# Altium schematic sheet Sheet1.SchDoc
size A; SheetNumber: 1; SheetTotal: 1
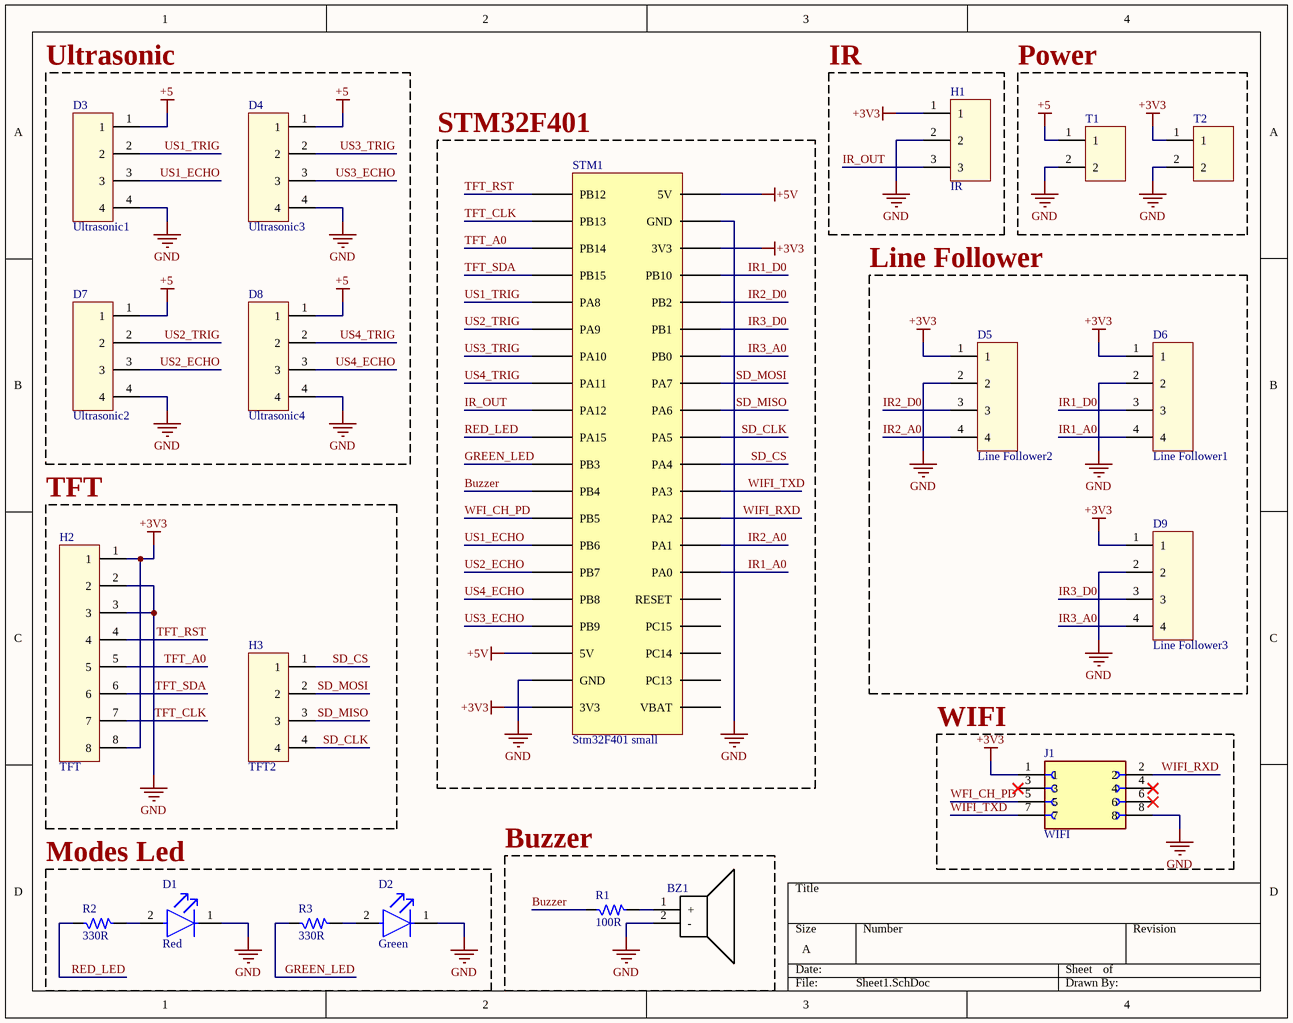
[diagram p0: Sheet1.SchDoc]

## Parts
BZ1  PS1440P02BT  [BUZZ_PS1440P02BT_TH]  (value not drawn)
D1  Red  [FP-HLMP-1301-MFG]
D2  Green  [FP-HLMP-1503-MFG]
D3  Ultrasonic1  [DATA_PIN_HEADER_4_2.54m]
D4  Ultrasonic3  [DATA_PIN_HEADER_4_2.54m]
D5  Line Follower2  [DATA_PIN_HEADER_4_2.54m]
D6  Line Follower1  [DATA_PIN_HEADER_4_2.54m]
D7  Ultrasonic2  [DATA_PIN_HEADER_4_2.54m]
D8  Ultrasonic4  [DATA_PIN_HEADER_4_2.54m]
D9  Line Follower3  [DATA_PIN_HEADER_4_2.54m]
H1  IR  [Female_Header_3]
H2  TFT  [Female_Header_8]
H3  TFT2  [Female_Header_4]
J1  WIFI  [SULLINS_PPPC042LFBN-RC]
R1  100R  [RES_1206]
R2  330R  [RES_0603]
R3  330R  [RES_0603]
STM1  Stm32F401 small  [Stm32F401CCU6]
T1  Terminal_block_2pins_5mm  [Terminal_block_2pins_5mm]  (value not drawn)
T2  Terminal_block_2pins_5mm  [Terminal_block_2pins_5mm]  (value not drawn)

## Blocks framed on the sheet
Ultrasonic: D3 D4 D7 D8
IR: H1
Power: T1 T2
STM32F401: STM1
Line Follower: D5 D6 D9
TFT: H2 H3
WIFI: J1
Modes Led: D1 D2 R2 R3
Buzzer: BZ1 R1

## Nets
+3V3: D5.1 D6.1 D9.1 H1.1 H2.1 H2.8 J1.1 STM1.3V3 T2.1
+5: D3.1 D4.1 D7.1 D8.1 T1.1
+5V: STM1.5V
GND: BZ1.2(-) D1.1(C) D2.1(C) D3.4 D4.4 D5.2 D6.2 D7.4 D8.4 D9.2 H1.2 H2.2 H2.3 J1.8 STM1.GND T1.2 T2.2
Buzzer: R1.1 STM1.PB4
GREEN_LED: R3.1 STM1.PB3
IR1_A0: D6.4 STM1.PA0
IR1_D0: D6.3 STM1.PB10
IR2_A0: D5.4 STM1.PA1
IR2_D0: D5.3 STM1.PB2
IR3_A0: D9.4 STM1.PB0
IR3_D0: D9.3 STM1.PB1
IR_OUT: H1.3 STM1.PA12
RED_LED: R2.1 STM1.PA15
SD_CLK: H3.4 STM1.PA5
SD_CS: H3.1 STM1.PA4
SD_MISO: H3.3 STM1.PA6
SD_MOSI: H3.2 STM1.PA7
TFT_A0: H2.5 STM1.PB14
TFT_CLK: H2.7 STM1.PB13
TFT_RST: H2.4 STM1.PB12
TFT_SDA: H2.6 STM1.PB15
US1_ECHO: D3.3 STM1.PB6
US1_TRIG: D3.2 STM1.PA8
US2_ECHO: D7.3 STM1.PB7
US2_TRIG: D7.2 STM1.PA9
US3_ECHO: D4.3 STM1.PB9
US3_TRIG: D4.2 STM1.PA10
US4_ECHO: D8.3 STM1.PB8
US4_TRIG: D8.2 STM1.PA11
WFI_CH_PD: J1.5 STM1.PB5
WIFI_RXD: J1.2 STM1.PA2
WIFI_TXD: J1.7 STM1.PA3
NetBZ1_1: BZ1.1(+) R1.2
NetD1_2: D1.2(A) R2.2
NetD2_2: D2.2(A) R3.2

Not connected (* = marked no-connect by the designer): J1 3* 4* 6*; STM1 PC13 PC14 PC15 RESET VBAT

## Library data of the parts
BZ1 = BUZZ_PS1440P02BT-30V-TH: Buzzers Transducer, Externally Driven Piezo 3V  4kHz 75dB @ 3V, 10cm Through Hole PC Pins; Manufacturer: TDK Corporation; Alternate Part Number-1: NA; Manufacturer Part Number: PS1440P02BT; Case/Package: TH; Supplier-1: SP ROAD; Supplier Part Number-1: NA
D1 = CMP-18399-000007-1: LED RED DIFFUSED T-1 T/H; Manufacturer: Broadcom; Forward Current: 10mA; Max Junction Temp: +110°C; Wavelength: 626nm; Led Orientation: Straight; Viewing Angle: 60°; Description: LED Uni-Color Red 635nm 2-Pin T-1; Luminous Intensity: 3.4mcd; Forward Voltage: 1.9V; Reverse Voltage: 5V; Peak Emmision Wavelength: 635nm; Mouser Description: Standard LEDs - Through Hole Red Diffused 635nm 3.4mcd; RoHS: TRUE; ComponentLink2Description: Datasheet; Device Class L1: Optoelectronics; Temperature Range High: +100°C; Manufacturer Part Number: HLMP-1301; ComponentLink2URL: https://docs.broadcom.com/docs/AV02-1555EN; Colour: Red; Digikey Description: LED RED DIFFUSED T-1 T/H; Automotive: No; Device Class L2: LEDs; Temperature Range Low: -40°C; Octopart: https://octopart.com/hlmp-1301-broadcom-71130345; Category: Diode; Lead Free: Yes; Device Class L3: unset; Package: 0; Temperature: -40°C to +100°C
D2 = CMP-18399-000010-1: LED GREEN DIFFUSED T-1 T/H; Manufacturer: Broadcom; Reverse Voltage: 5V; Wavelength: 569nm; Forward Voltage: 2.1V; Led Orientation: Straight; Viewing Angle: 60°; Max Junction Temp: +110°C; Peak Emmision Wavelength: 565nm; Luminous Intensity: 1mcd; Standoff Height: 0.88mm; Forward Current: 10mA; Mouser Description: LED; Green; 1mcd; 0.115In.Dia.; T-1; 565nm; 25mA; 2.1V; 5V; GaP; -20degC; 100deg; ComponentLink2Description: Datasheet; Digikey Description: LED GREEN DIFFUSED T-1 T/H; Device Class L1: Optoelectronics; Device Class L3: unset; Automotive: No; Device Class L2: LEDs; Manufacturer Part Number: HLMP-1503; Category: Diode; Temperature Range Low: -20°C; Height: 6.35mm; RoHS: TRUE; Octopart: https://octopart.com/hlmp-1503-broadcom-71130371; Temperature: -20°C to +100°C; Lead Free: Yes; ComponentLink2URL: https://docs.broadcom.com/docs/AV02-1555EN; Package: HLMP-1503; Colour: Green; Temperature Range High: +100°C
D3-D9 = DATA_PIN_HEADER_4_2.54m
H1 = FEMALE_HEADER_3
H2 = FEMALE_HEADER_8
H3 = FEMALE_HEADER_4
J1 = PPPC042LFBN-RC: 8 Position Total Dual Row 2.54 mm Pitch Straight Female Header; MF: Sullins Connector Solutions; MP: PPPC042LFBNRC; SnapEDA_Link: https://www.snapeda.com/parts/PPPC042LFBNRC/Sullins/view-part/?ref=snap; Package: None; Value: *; Check_prices: https://www.snapeda.com/parts/PPPC042LFBNRC/Sullins/view-part/?ref=eda
R1 = RES_10R-0.25W-5%-1206: 10 Ohms ±5% 0.25W, 1/4W Chip Resistor 1206 (3216 Metric) Automotive AEC-Q200 Thick Film; Manufacturer: Yageo; Manufacturer Part Number: RMCF1206JT10R0; Alternate Part Number-1: NA; Case/Package: 1206; Supplier-1: SIRICOM; Supplier Part Number-1: WR12X10R0FTL
R2 R3 = RES_2.2K-0.1W-1%-0603: 2.2 kOhms ±1% 0.1W, 1/10W Chip Resistor 0603 (1608 Metric) Automotive AEC-Q200 Thick Film; Manufacturer: Walsin; Manufacturer Part Number: WR06X2201FTL; Case/Package: 0603; Supplier-1: SIRICOM; Supplier Part Number-1: WR06X2201FTL; Alternate Part Number-1: WR06X2201FTL